# EAGLE design switching_regulator (EAGLE 5.10)
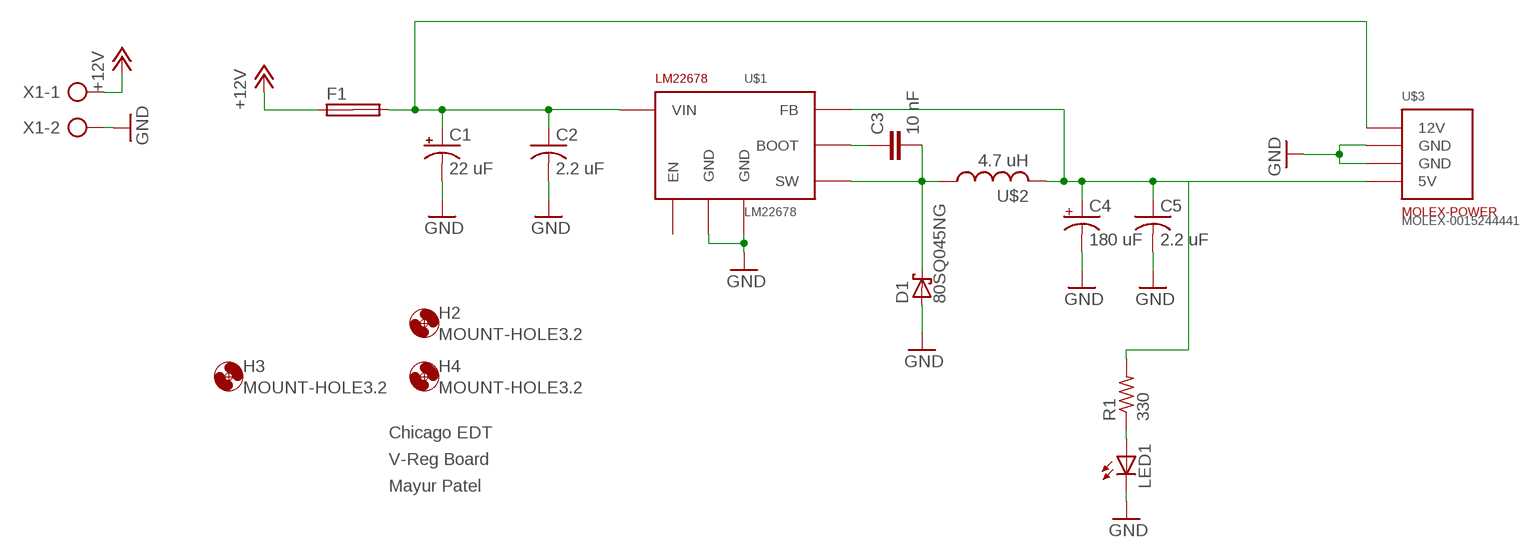
[diagram p0: schematic, sheet 1]

## Parts
C1  22 uF  CPOL-USTAP5-60  [TAP5-60]
C2  2.2 uF  C-US050-025X075  [C050-025X075]
C3  10 nF  C2,5-3  [C2.5-3]
C4  180 uF  CPOL-USE5-10.5  [E5-10,5]
C5  2.2 uF  C-US050-025X075  [C050-025X075]
D1  80SQ045NG  SCHOTTKY-DIODECB429-17  [CB429-17]
F1  SHK20Q  [SHK20Q]
H2  MOUNT-HOLE3.2  [3,2]
H3  MOUNT-HOLE3.2  [3,2]
H4  MOUNT-HOLE3.2  [3,2]
LED1  LED3MM  [LED3MM]
R1  330  R-US_0204/7  [0204/7]
U$1  LM22678  [TO263-7]
U$2  4.7 uH  COILTRONICS-DR127  [COILTRONICS-DR127]
U$3  MOLEX-0015244441  [MOLEX-0015244441]
X1  AK300/2  [AK300/2]

## Nets
+12V: F1.1A X1.1
GND: C1.- C2.2 C4.- C5.2 D1.A LED1.K(C) U$1.4(GND) U$1.EP(GND) U$3.2(GND) U$3.3(GND) X1.2
N$1: C4.+ C5.1 R1.2 U$1.6(FB) U$2.2 U$3.4(5V)
N$2: C3.2 D1.C U$1.1(SW) U$2.1
N$3: C3.1 U$1.3(BOOT)
N$4: C1.+ C2.1 F1.2A U$1.2(VIN) U$3.1(12V)
N$5: LED1.A R1.1
Unconnected: F1.1B F1.2B U$1.7(EN)

## Notes on the sheet
- Chicago EDT
- V-Reg Board
- Mayur Patel

## Library data of the parts
C1 C4 = rcl:CPOL-US: POLARIZED CAPACITOR, American symbol
C2 C5 = rcl:C-US: CAPACITOR, American symbol
C3 = capacitor-wima:C: CAPACITOR naming: grid - package width
D1 = diode:SCHOTTKY-DIODE: Schottky Diode
F1 = fuse:SHK20Q: FUSE HOLDER 5 x 20 mm, SH contact, E1207 Buerklin 64G6061
H2-H4 = holes:MOUNT-HOLE: MOUNTING HOLE with drill center marker
LED1 = led:LED: LED OSRAM: - CHIPLED LG R971, LG N971, LY N971, LG Q971, LY Q971, LO R971, LY R971 LH N974, LH R974 LS Q976, LO Q976, LY Q976 LO Q996 - Hyper CHIPLED LW Q18S LB Q993, LB Q99A, LB R99A - SideLED LS A670, LO A670, LY A670, LG A670, LP A670 LB A673, LV A673, LT A673, LW A673 LH A674 LY A675 LS A676, LA A676, LO A676, LY A676, LW A676 LS A679, LY A679, LG A679 - Hyper Micro SIDELED® LS Y876, LA Y876, LO Y876, LY Y876 LT Y87S - SmartLED LW L88C, LW L88S LB L89C, LB L89S, LG L890 LS L89K, LO L89K, LY L89K LS L896, LA L896, LO L896, LY L896 - TOPLED LS T670, LO T670, LY T670, LG T670, LP T670 LSG T670, LSP T670, LSY T670, LOP T670, LYG T670 LG T671, LOG T671, LSG T671 LB T673, LV T673, LT T673, LW T673 LH T674 LS T676, LA T676, LO T676, LY T676, LB T676, LH T676, LSB T676, LW T676 LB T67C, LV T67C, LT T67C, LS T67K, LO T67K, LY T67K, LW E67C LS E67B, LA E67B, LO E67B, LY E67B, LB E67C, LV E67C, LT E67C LW T67C LS T679, LY T679, LG T679 LS T770, LO T770, LY T770, LG T770, LP T770 LB T773, LV T773, LT T773, LW T773 LH T774 LS E675, LA E675, LY E675, LS T675 LS T776, LA T776, LO T776, LY T776, LB T776 LHGB T686 LT T68C, LB T68C - Hyper Mini TOPLED® LB M676 - Mini TOPLED Santana® LG M470 LS M47K, LO M47K, LY M47K Source: http://www.osram.convergy.de LUXEON: - LUMILED® LXK2-PW12-R00, LXK2-PW12-S00, LXK2-PW14-U00, LXK2-PW14-V00 LXK2-PM12-R00, LXK2-PM12-S00, LXK2-PM14-U00 LXK2-PE12-Q00, LXK2-PE12-R00, LXK2-PE12-S00, LXK2-PE14-T00, LXK2-PE14-U00 LXK2-PB12-K00, LXK2-PB12-L00, LXK2-PB12-M00, LXK2-PB14-N00, LXK2-PB14-P00, LXK2-PB14-Q00 LXK2-PR12-L00, LXK2-PR12-M00, LXK2-PR14-Q00, LXK2-PR14-R00 LXK2-PD12-Q00, LXK2-PD12-R00, LXK2-PD12-S00 LXK2-PH12-R00, LXK2-PH12-S00 LXK2-PL12-P00, LXK2-PL12-Q00, LXK2-PL12-R00 Source: www.luxeon.com KINGBRIGHT: KA-3528ASYC Source: www.kingbright.com
R1 = rcl:R-US_: RESISTOR, American symbol
U$1 = chicagoedt:LM22678: 5A SIMPLE SWITCHER®, Step-Down Voltage Regulator with Precision Enable
U$2 = chicagoedt:COILTRONICS-DR127: Coiltronics DR127 series surface mount inductor.
U$3 = chicagoedt:MOLEX-0015244441: 5.08mm (.200") Pitch Disk Drive Power Connection System Header, Right Angle, Through Hole, 4 Circuits, Lead-free, 3.56mm (.140") PC Tail Length, with PCB Locator Peg
X1 = con-ptr500:AK300/2: CONNECTOR

## Board
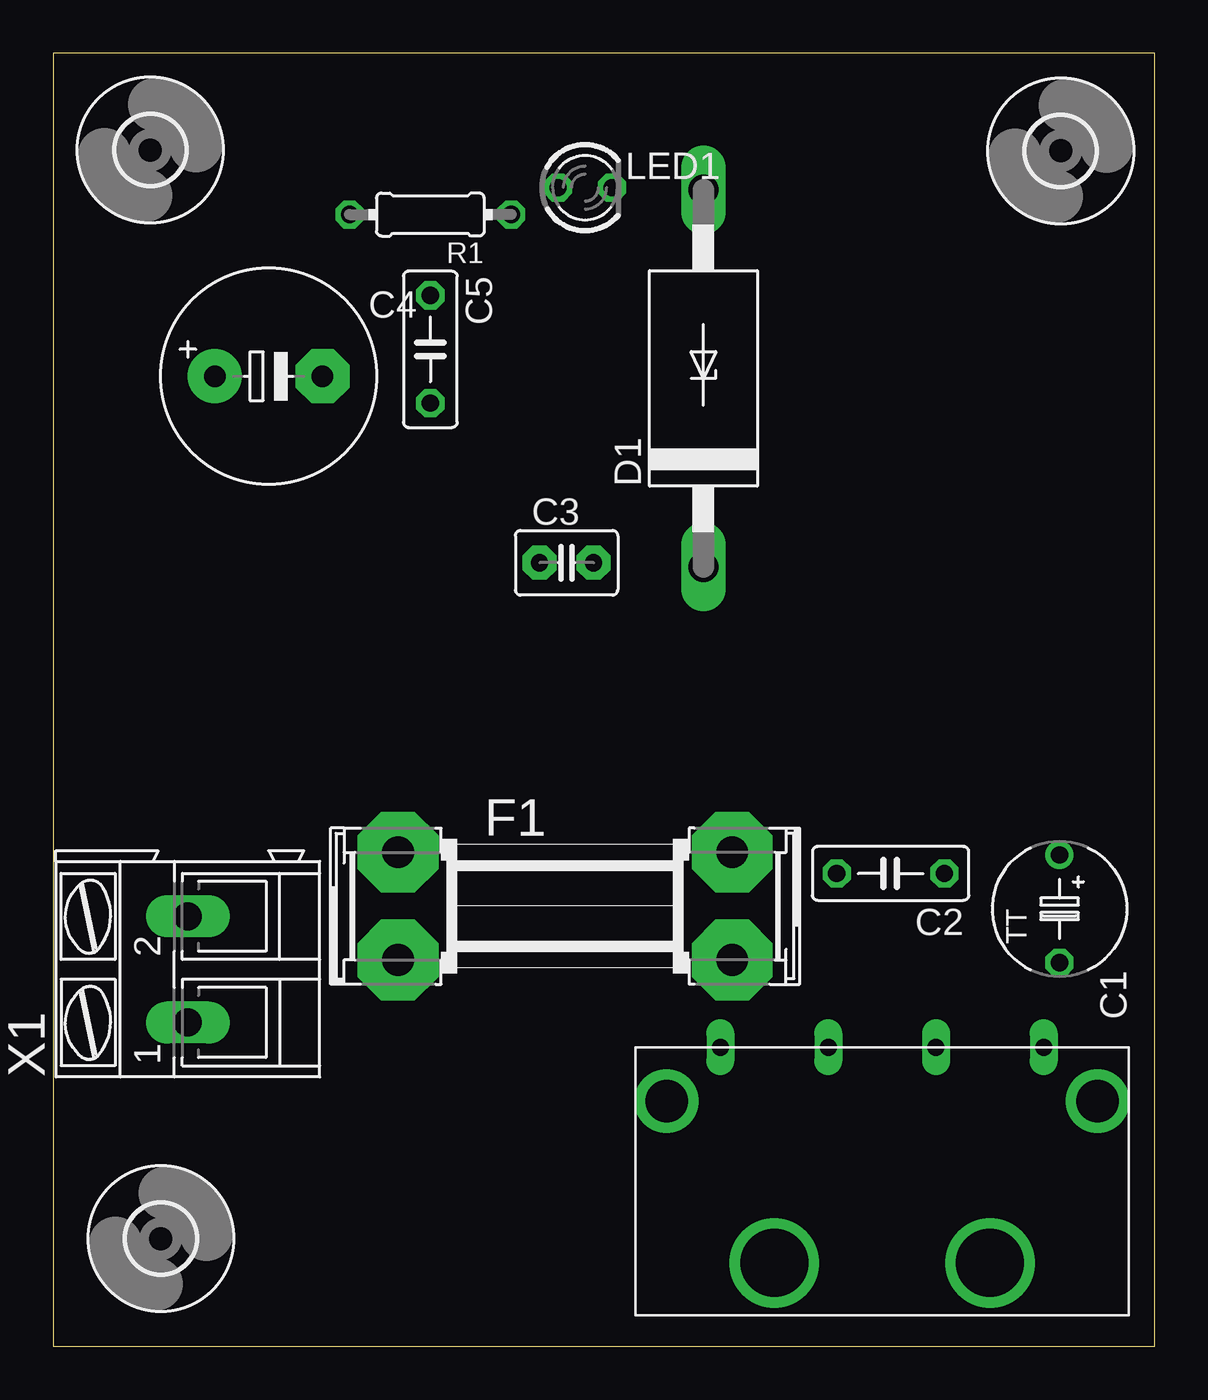
[diagram p1: board, top side]
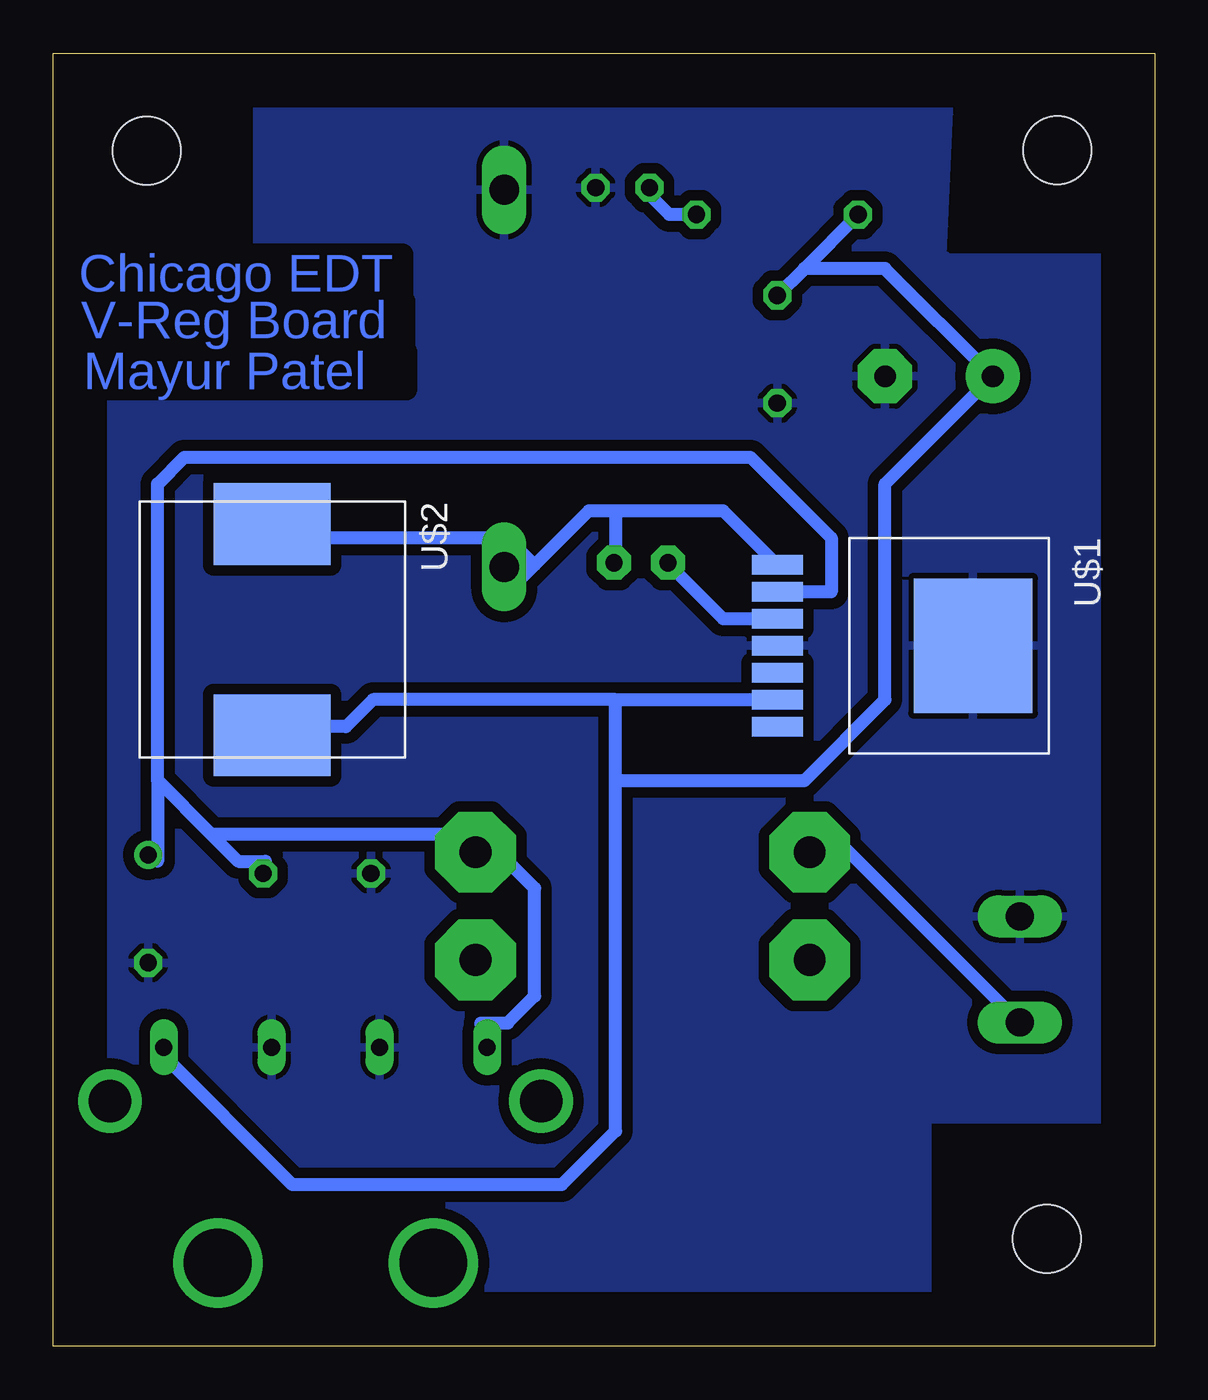
[diagram p2: board, bottom side, seen from below]

Size 51.91 x 60.95 mm. Coordinates in mm from the lower left corner, seen from the top.
Outline: 0,0 51.91,0 51.91,60.95 0,60.95 0,0
Copper layers (1*16): Top 0.035mm / dielectric 1.5mm / Bottom 0.035mm
Design rules "default *": minimum track width 24mil, minimum drill 24mil, track to track 20mil, track to pad 20mil, pad to pad 20mil, via to via 10mil, smd to smd 10mil, copper to edge 100mil, drill to drill 8mil, minimum pad ring 10mil, minimum via ring 8mil, stop-mask expansion 4mil, vias tented up to drill 0mil, thermal gap 10mil

### Footprints (pad centres in the part's own frame; a part is rotated, then mirrored left to right if it is on the bottom)
TAP5-60 = drill 0.813 round: + -2.54,0 | drill 0.813 octagon: - 2.54,0
C050-025X075 = drill 0.813 octagon: 1 -2.54,0; 2 2.54,0
C2.5-3 = drill 0.813 pad 1.6 octagon: 1 -1.27,0; 2 1.27,0
E5-10,5 = drill 1.016 pad 2.54 round: + -2.54,0 | drill 1.016 pad 2.54 octagon: - 2.54,0
CB429-17 = drill 1.397 long: A 8.89,0; C -8.89,0
SHK20Q = drill 1.5 pad 3.81 octagon: 1A -7.874,2.54; 1B -7.874,-2.54; 2A 7.874,2.54; 2B 7.874,-2.54
3,2 = hole 3.2: 0,0
LED3MM = drill 0.813 octagon: A -1.27,0; K 1.27,0
0204/7 = drill 0.813 octagon: 1 -3.81,0; 2 3.81,0
TO263-7 = smd 0.91 x 2.41: 1 -3.81,0; 2 -2.54,0; 3 -1.27,0; 4 0,0; 5 1.27,0; 6 2.54,0; 7 3.81,0 | smd 6.35 x 5.59: EP 0,9.225
COILTRONICS-DR127 = smd 3.85 x 5.5: 1 -4.975,0; 2 4.975,0
MOLEX-0015244441 = drill 0.8 long: 1 7.62,-6.35; 2 2.54,-6.35; 3 -2.54,-6.35; 4 -7.62,-6.35 | drill 2 pad 2.54 round: P$1 -10.16,-3.81; P$2 10.16,-3.81 | drill 3.2 pad 3.988 round: P$3 5.08,3.81; P$4 -5.08,3.81
AK300/2 = drill 1.321 long: 1 -2.515,0; 2 2.489,0

### Placement (x,y rotation side)
C1  47.43,20.62 270 top
C2  39.47,22.29 180 top
C3  24.2,36.93 0 top
C4  10.16,45.72 0 top
C5  17.78,46.99 270 top
D1  30.65,45.62 90 top
F1  24.13,20.75 0 top
H2  47.49,56.34 0 top
H3  5.08,5.08 0 top
H4  4.58,56.38 0 top
LED1  25.07,54.61 0 top
R1  17.78,53.34 180 top
U$1  17.78,33.02 270 bottom
U$2  41.58,33.78 270 bottom
U$3  39.07,7.75 180 top
X1  6.35,17.78 90 top

### Tracks (layer width: path | path; a pad name or v marks a point on that pad's centre or on a via)
+12V
  Bottom 0.61: X1.1 6.35,15.24 15.24,24.13 F1.1A
GND
  pour Bottom: 42.3,60.3 42.3,59.3 42.3,51 51.4,51 51.4,50.2 51.4,1 10.7,1 10.7,1.5 10.7,10.7 0.4,10.7 0.5,51.3 9.8,51.3 9.8,51.4 10,51.4 9.6,60.4
N$1
  Bottom 0.61: 16.51,50.8 R1.2 | 16.51,50.8 C5.1 | 16.51,50.8 12.7,50.8 C4.+ 12.7,40.64 12.7,30.48 16.51,26.67 25.4,26.67 | 25.4,30.48 36.83,30.48 38.1,29.21 40.64,29.21 U$2.2 | 25.4,30.48 U$1.6 | 25.4,26.67 25.4,30.48 | 25.4,26.67 25.4,10.16 27.94,7.62 40.64,7.62 46.99,13.97 U$3.4
N$2
  Bottom 0.61: U$1.1 20.32,39.37 25.4,39.37 | 25.4,39.37 26.67,39.37 29.21,36.83 | 29.21,36.83 30.48,35.56 D1.C | 25.4,39.37 25.4,36.83 C3.2 | 29.21,36.83 30.48,38.1 40.64,38.1 U$2.1
N$3
  Bottom 0.61: U$1.3 20.32,34.29 22.86,36.83 C3.1
N$4
  Bottom 0.61: U$3.1 31.75,15.24 30.48,15.24 29.21,16.51 29.21,21.59 31.75,24.13 F1.2A 33.02,24.13 44.45,24.13 | U$1.2 15.24,35.56 15.24,38.1 19.05,41.91 45.72,41.91 46.99,40.64 46.99,26.67 | 46.99,26.67 46.99,22.86 C1.+ | 44.45,24.13 46.99,26.67 | 44.45,24.13 43.18,22.86 41.91,22.86 C2.1
N$5
  Bottom 0.61: R1.1 22.86,53.34 24.13,54.61 LED1.A

### Text on the board
Bottom: Chicago EDT | V-Reg Board | Mayur Patel